# EAGLE design zxclone (EAGLE 6.4)
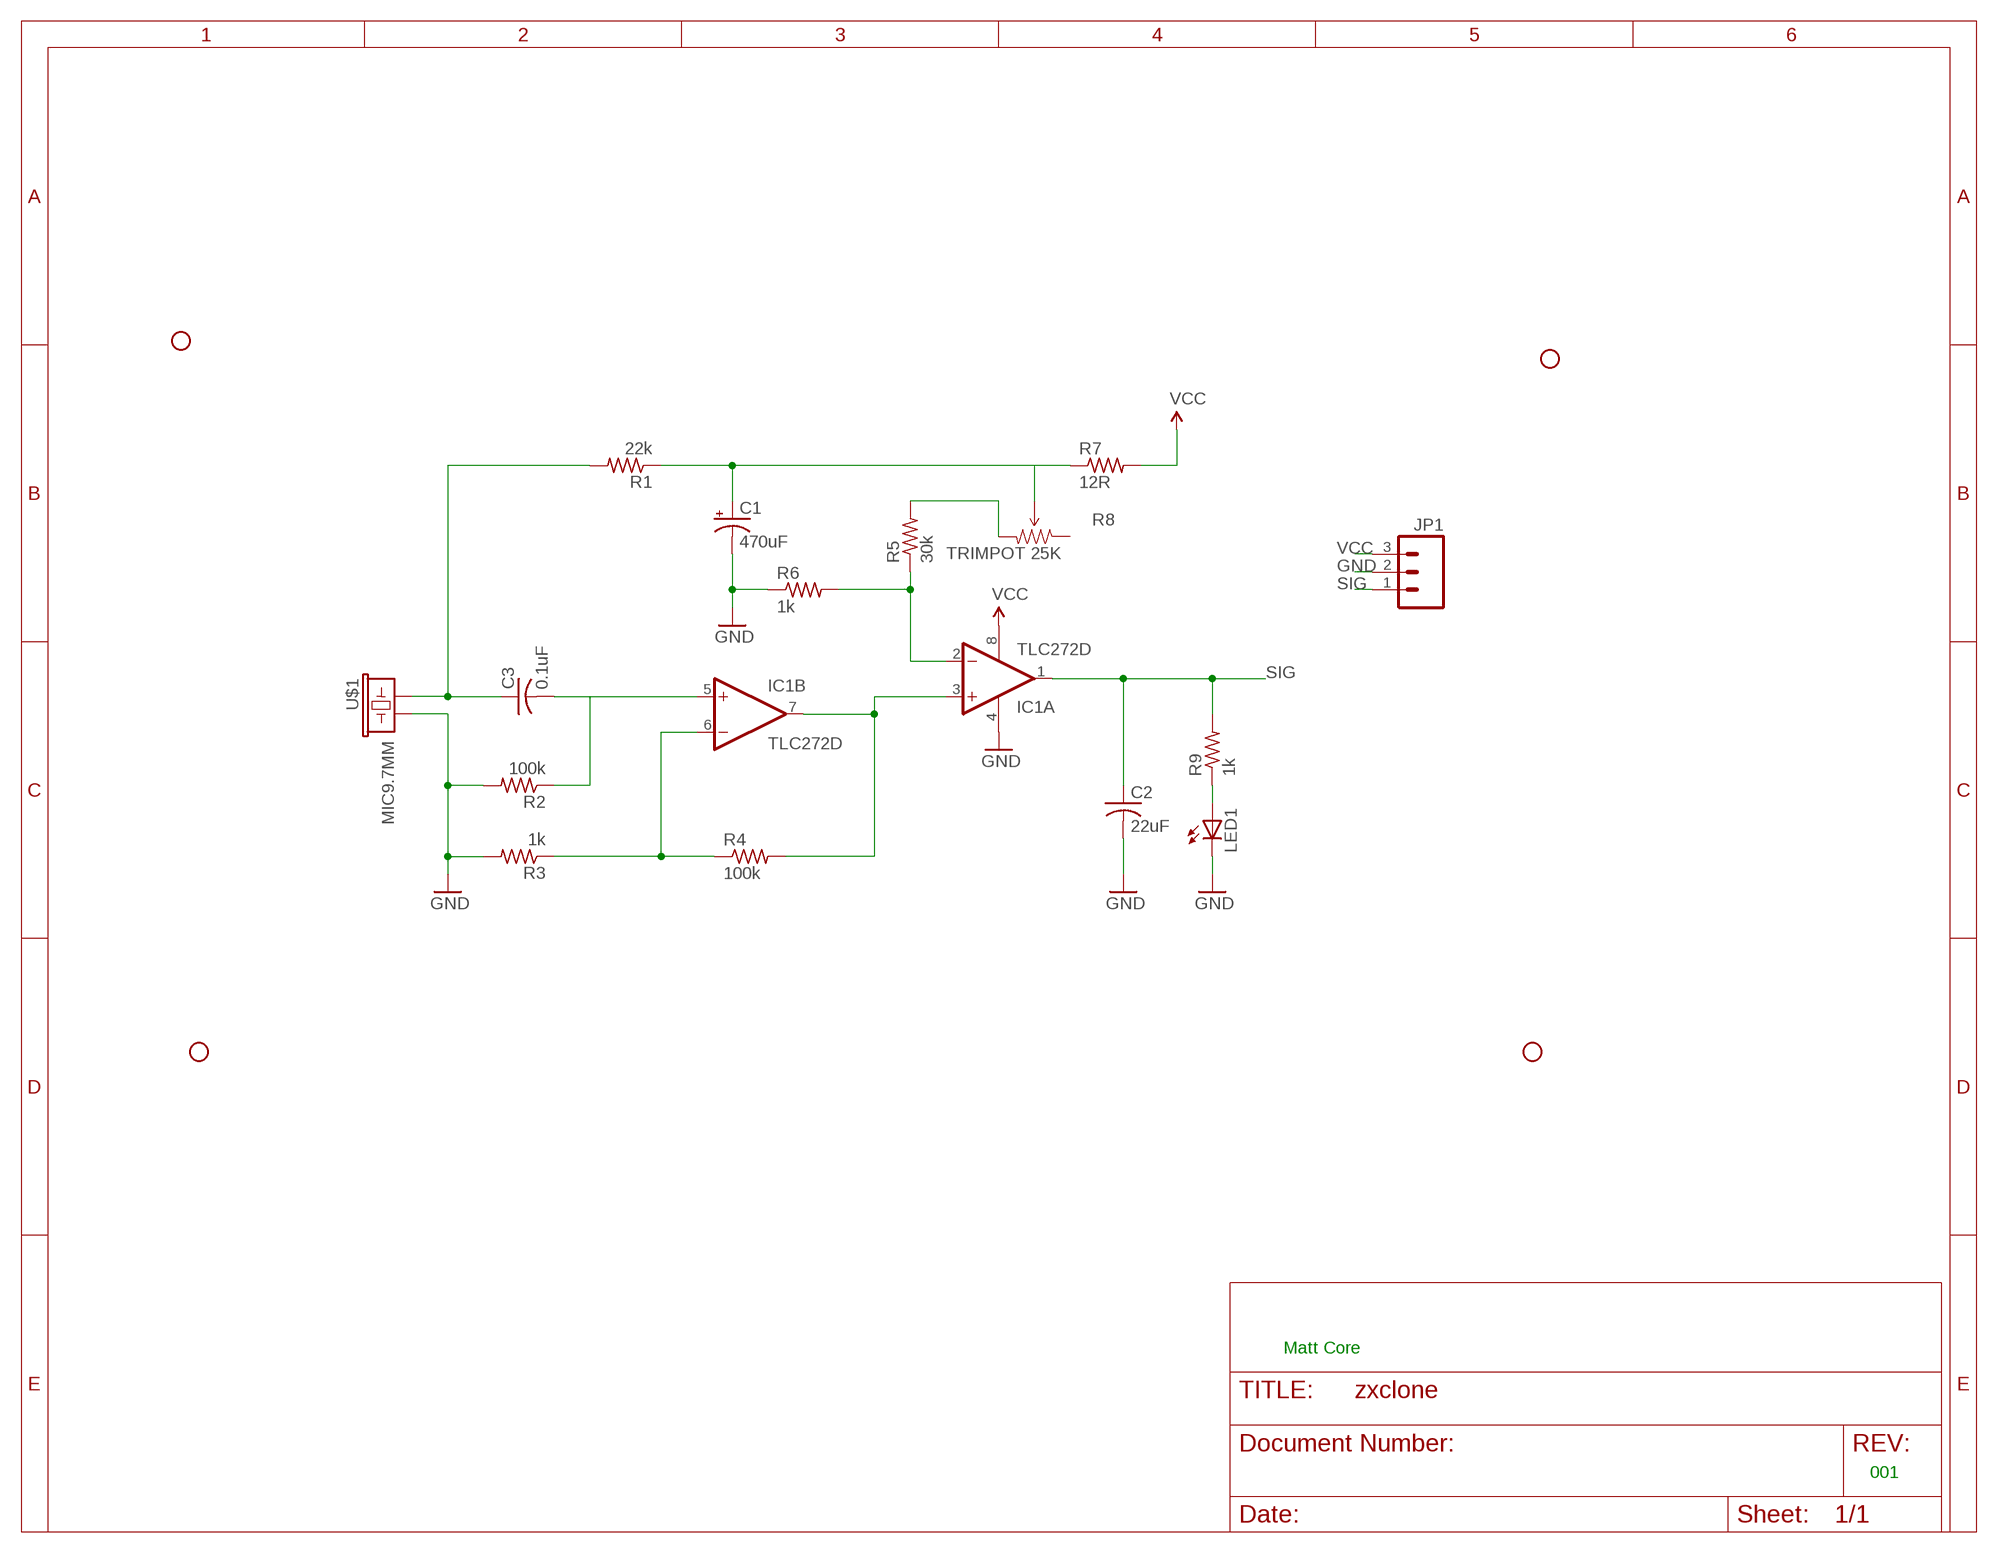
[diagram p0: schematic, sheet 1]

## Parts
C1  470uF  CPOL-USE2.5-7  [E2,5-7]
C2  22uF  C-USC1206  [C1206]
C3  0.1uF  C-USC1005  [C1005]
IC1  TLC272D  [SO08]
JP1  M03PTH  [1X03]
LED1  LEDSML0603  [SML0603]
R1  22k  R-US_R0402  [R0402]
R2  100k  R-US_R0402  [R0402]
R3  1k  R-US_R0402  [R0402]
R4  100k  R-US_R0402  [R0402]
R5  30k  R-US_R0402  [R0402]
R6  1k  R-US_R0402  [R0402]
R7  12R  R-US_R0805  [R0805]
R8  TRIMPOT 25K  TRIMPOT-2  [TRIMPOT_TC33]
R9  1k  R-US_R0402  [R0402]
STANDOFF1  STAND-OFF  [STAND-OFF]
STANDOFF2  STAND-OFF  [STAND-OFF]
STANDOFF3  STAND-OFF  [STAND-OFF]
STANDOFF4  STAND-OFF  [STAND-OFF]
U$1  MIC9.7MM  [MIC-9.7MM]

## Nets
GND [ground]: C1.- C2.2 IC1.4(P:V-) JP1.2 LED1.C R2.2 R3.2 R6.1 U$1.2
N$1 [vcc]: C1.+ R1.1 R7.1 R8.2(WIPER)
N$2: IC1.2(A:-IN) R5.1 R6.2
N$3: IC1.3(A:+IN) IC1.7(B:OUT) R4.2
N$4: IC1.6(B:-IN) R3.1 R4.1
N$5: C3.2 IC1.5(B:+IN) R2.1
N$6: R5.2 R8.3(CW)
N$7 [vcc]: C3.1 R1.2 U$1.1
N$8: LED1.A R9.1
SIG: C2.1 IC1.1(A:OUT) JP1.1 R9.2
VCC [vcc]: IC1.8(P:V+) JP1.3 R7.2
Unconnected: R8.1(CCW)

## Notes on the sheet
- Matt Core
- 001

## Library data of the parts
C1 = resistor:CPOL-US: POLARIZED CAPACITOR, American symbol
C2 C3 = resistor:C-US: CAPACITOR, American symbol
IC1 = linear:TLC272: OP AMP
JP1 = SparkFun-Connectors:M03: Header 3 Standard 3-pin 0.1" header. Use with straight break away headers (SKU : PRT-00116), right angle break away headers (PRT-00553), swiss pins (PRT-00743), machine pins (PRT-00117), and female headers (PRT-00115). Molex polarized connector foot print use with SKU : PRT-08232 with associated crimp pins and housings.
LED1 = led:LED: LED OSRAM: - CHIPLED LG R971, LG N971, LY N971, LG Q971, LY Q971, LO R971, LY R971 LH N974, LH R974 LS Q976, LO Q976, LY Q976 LO Q996 - Hyper CHIPLED LW Q18S LB Q993, LB Q99A, LB R99A - SideLED LS A670, LO A670, LY A670, LG A670, LP A670 LB A673, LV A673, LT A673, LW A673 LH A674 LY A675 LS A676, LA A676, LO A676, LY A676, LW A676 LS A679, LY A679, LG A679 - Hyper Micro SIDELED® LS Y876, LA Y876, LO Y876, LY Y876 LT Y87S - SmartLED LW L88C, LW L88S LB L89C, LB L89S, LG L890 LS L89K, LO L89K, LY L89K LS L896, LA L896, LO L896, LY L896 - TOPLED LS T670, LO T670, LY T670, LG T670, LP T670 LSG T670, LSP T670, LSY T670, LOP T670, LYG T670 LG T671, LOG T671, LSG T671 LB T673, LV T673, LT T673, LW T673 LH T674 LS T676, LA T676, LO T676, LY T676, LB T676, LH T676, LSB T676, LW T676 LB T67C, LV T67C, LT T67C, LS T67K, LO T67K, LY T67K, LW E67C LS E67B, LA E67B, LO E67B, LY E67B, LB E67C, LV E67C, LT E67C LW T67C LS T679, LY T679, LG T679 LS T770, LO T770, LY T770, LG T770, LP T770 LB T773, LV T773, LT T773, LW T773 LH T774 LS E675, LA E675, LY E675, LS T675 LS T776, LA T776, LO T776, LY T776, LB T776 LHGB T686 LT T68C, LB T68C - Hyper Mini TOPLED® LB M676 - Mini TOPLED Santana® LG M470 LS M47K, LO M47K, LY M47K Source: http://www.osram.convergy.de LUXEON: - LUMILED® LXK2-PW12-R00, LXK2-PW12-S00, LXK2-PW14-U00, LXK2-PW14-V00 LXK2-PM12-R00, LXK2-PM12-S00, LXK2-PM14-U00 LXK2-PE12-Q00, LXK2-PE12-R00, LXK2-PE12-S00, LXK2-PE14-T00, LXK2-PE14-U00 LXK2-PB12-K00, LXK2-PB12-L00, LXK2-PB12-M00, LXK2-PB14-N00, LXK2-PB14-P00, LXK2-PB14-Q00 LXK2-PR12-L00, LXK2-PR12-M00, LXK2-PR14-Q00, LXK2-PR14-R00 LXK2-PD12-Q00, LXK2-PD12-R00, LXK2-PD12-S00 LXK2-PH12-R00, LXK2-PH12-S00 LXK2-PL12-P00, LXK2-PL12-Q00, LXK2-PL12-R00 Source: www.luxeon.com KINGBRIGHT: KA-3528ASYC Source: www.kingbright.com
R1-R7 R9 = resistor:R-US_: RESISTOR, American symbol
R8 = SparkFun-Electromechanical:TRIMPOT: Various small potentiometers for "set-and-forget" applications
STANDOFF1-STANDOFF4 = SparkFun-Electromechanical:STAND-OFF: #4 Stand Off This is the mechanical footprint for a #4 phillips button head screw. Use the keepout ring to avoid running the screw head into surrounding components. SKU : PRT-00447
U$1 = SparkFun-Sensors:MIC: Omni-directional electret microphone. 9.7mm standard diameter.

## Net classes
1 ground: width 0.406 mm
2 vcc: width 0.406 mm

## Board
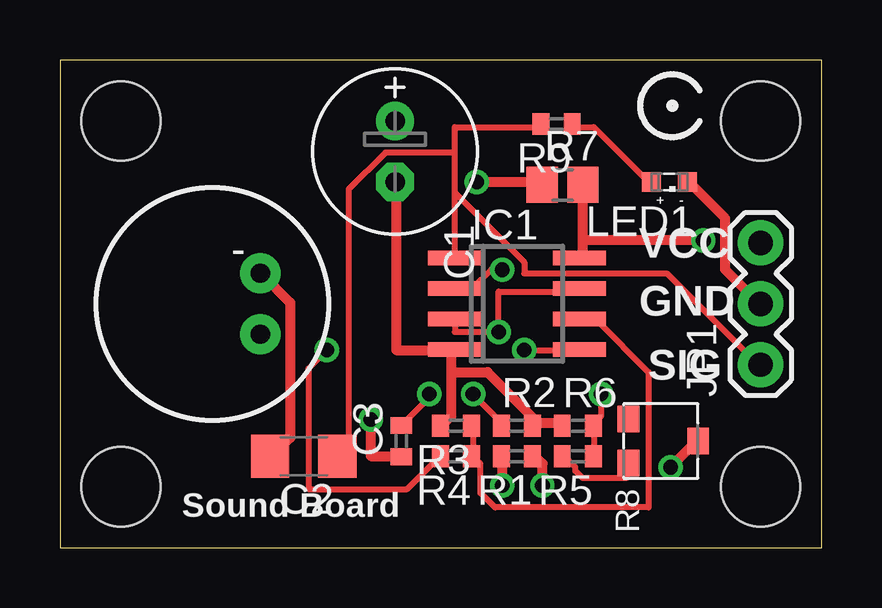
[diagram p1: board, top side]
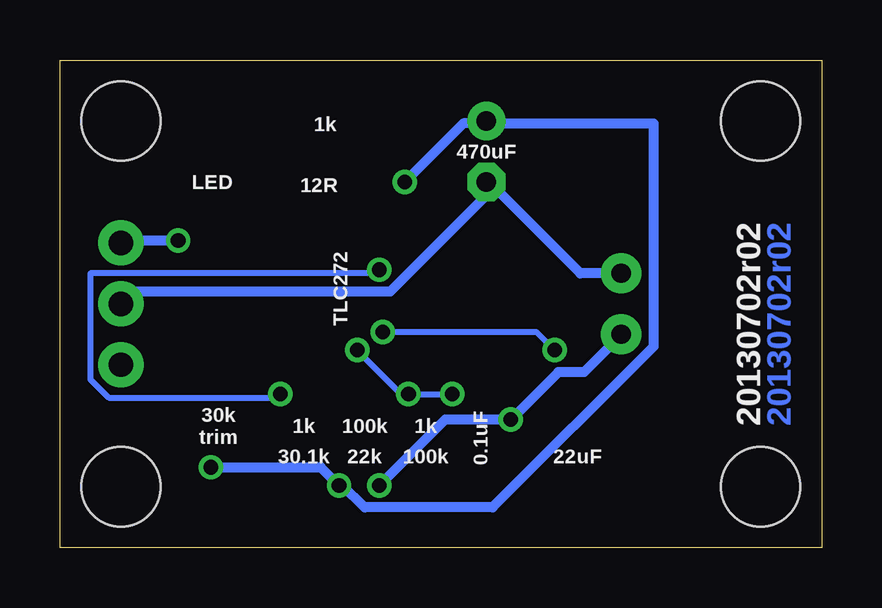
[diagram p2: board, bottom side, seen from below]

Size 31.75 x 20.32 mm. Coordinates in mm from the lower left corner, seen from the top.
Outline: 0,0 31.75,0 31.75,20.32 0,20.31 0,0
Copper layers (1*16): Top 0.035mm / dielectric 1.5mm / Bottom 0.035mm
Design rules "default *": minimum track width 10mil, minimum drill 24mil, track to track 8mil, track to pad 8mil, pad to pad 8mil, via to via 8mil, smd to smd 8mil, copper to edge 40mil, drill to drill 8mil, minimum pad ring 10mil, minimum via ring 8mil, stop-mask expansion 4mil, vias tented up to drill 25mil, thermal gap 10mil

### Footprints (pad centres in the part's own frame; a part is rotated, then mirrored left to right if it is on the bottom)
E2,5-7 = drill 0.813 pad 1.6: + -1.27,0 | drill 0.813 pad 1.6 octagon: - 1.27,0
C1206 = smd 1.6 x 1.8: 1 -1.4,0; 2 1.4,0
C1005 = smd 0.7 x 0.9: 1 -0.65,0; 2 0.65,0
SO08 = smd 0.6 x 2.2: 1 -1.905,-2.6; 2 -0.635,-2.6; 3 0.635,-2.6; 4 1.905,-2.6; 5 1.905,2.6; 6 0.635,2.6; 7 -0.635,2.6; 8 -1.905,2.6
1X03 = drill 1.016 pad 1.88: 1 0,0; 2 2.54,0; 3 5.08,0
SML0603 = smd 0.8 x 0.8: A 0.75,0; C -0.75,0
R0402 = smd 0.7 x 0.9: 1 -0.65,0; 2 0.65,0
R0805 = smd 1.3 x 1.5: 1 -0.85,0; 2 0.85,0
TRIMPOT_TC33 = smd 1.1 x 0.9: 1 -0.91,-1.45; 2 0,1.45; 3 0.91,-1.45
STAND-OFF = hole 3.302: 0,0
MIC-9.7MM = drill 0.8 pad 1.676: 1 -2,1.27; 2 -2,-1.27

### Placement (x,y rotation side)
C1  13.97,16.51 270 top
C2  10.16,3.81 180 top
C3  14.22,4.45 90 top
FRAME1  FRAME-LETTER  [CREATIVE_COMMONS]  5.08,22.86 0 top
IC1  19.05,10.16 270 top
JP1  29.21,7.62 90 top
LED1  25.4,15.24 180 top
R1  19.05,3.81 180 top
R2  19.05,5.08 0 top
R3  16.51,5.08 180 top
R4  16.51,3.81 180 top
R5  21.59,3.81 180 top
R6  21.59,5.08 0 top
R7  20.95,15.11 0 top
R8  25.15,4.45 270 top
R9  20.7,17.65 180 top
STANDOFF1  2.54,17.78 0 top
STANDOFF2  29.21,17.78 0 top
STANDOFF3  2.54,2.54 0 top
STANDOFF4  29.21,2.54 0 top
U$1  6.35,10.16 180 top

### Tracks (layer width: path | path; a pad name or v marks a point on that pad's centre or on a via)
GND
  Top 0.406: LED1.C 26.21,15.24 27.74,13.72 27.74,11.58 29.11,10.21 JP1.2 | R6.1 20.88,5.18 19.81,5.18 R2.2 19.81,5.33 17.83,7.32 16.31,7.32 | 16.31,7.32 16.31,8.23 IC1.4 16.15,8.23 14.02,8.23 14.02,15.24 C1.- | 16.31,7.32 16.31,5.49 16,5.18 R3.2 | C2.2 8.84,3.81 9.6,4.57 9.6,10.21 8.38,11.43 U$1.2
  Bottom 0.406: U$1.2 10.06,11.43 13.87,15.24 C1.- 13.72,14.94 17.98,10.67 28.65,10.67 29.11,10.21 JP1.2
N$1  (via drill 0.61)
  Top 0.406: v20.12,2.59 20.12,3.5 19.81,3.81 R1.1 | v25.45,3.35 26.52,4.42 R8.2 | v17.37,15.24 19.96,15.24 R7.1
  Bottom 0.406: v25.45,3.35 20.88,3.35 v20.12,2.59 19.96,2.59 19.05,1.68 13.72,1.68 7.01,8.38 7.01,17.68 13.87,17.68 C1.+ 14.02,17.68 14.94,17.68 v17.37,15.24
N$2  (via drill 0.61)
  Top 0.254: R5.1 22.25,5.03 R6.2 22.25,5.18 22.55,5.49 v22.55,6.4 | v18.44,11.58 17.98,11.58 17.22,10.82 16.46,10.82 IC1.2
  Bottom 0.254: v22.55,6.4 22.71,6.25 29.72,6.25 30.48,7.01 30.48,11.43 18.59,11.43 v18.44,11.58
N$3  (via drill 0.61)
  Top 0.254: v11.12,8.23 10.36,7.47 10.36,2.44 14.48,2.44 R4.2 | IC1.3 16.46,9.45 16.46,8.99 v18.29,8.99 18.29,10.67 21.64,10.67 IC1.7
  Bottom 0.254: v11.12,8.23 11.89,8.99 v18.29,8.99
N$4
  Top 0.254: 17.22,3.81 17.22,5.03 R3.1 | 17.22,3.81 17.53,3.5 17.53,2.29 18.14,1.68 24.54,1.68 24.54,7.32 22.4,9.45 21.79,9.45 IC1.6 | 17.22,3.81 R4.1
N$5  (via drill 0.61)
  Top 0.254: v15.39,6.4 15.39,6.25 14.33,5.18 C3.2 | v17.22,6.4 18.29,5.33 18.29,5.18 R2.1 | v19.36,8.23 21.64,8.23 IC1.5
  Bottom 0.254: v15.39,6.4 v17.22,6.4 17.53,6.4 v19.36,8.23
N$6
  Top 0.254: R5.2 21.03,3.81 21.49,3.35 21.49,3.2 21.79,2.9 23.62,2.9 23.62,3.5 R8.3
N$7  (via drill 0.61)
  Top 0.406: v12.95,5.33 12.95,3.81 14.17,3.81 C3.1 | v18.44,2.59 18.44,3.81 R1.2
  Bottom 0.406: U$1.1 8.38,8.84 9.91,7.32 10.97,7.32 v12.95,5.33 15.7,5.33 v18.44,2.59
N$8
  Top 0.254: LED1.A 24.54,15.24 22.25,17.53 21.49,17.53 R9.1
SIG
  Top 0.254: 16.46,14.78 16.46,12.19 IC1.1 | 16.46,14.78 16.46,16.46 | 16.46,16.46 16.46,17.53 19.96,17.53 R9.2 | 16.46,16.46 13.56,16.46 12.04,14.94 12.04,4.27 11.58,3.81 C2.1 | 16.46,14.78 19.36,11.89 19.36,11.43 25.3,11.43 29.11,7.62 JP1.1
VCC  (via drill 0.61)
  Top 0.406: 21.79,12.8 21.79,12.19 IC1.8 | 21.79,12.8 21.79,15.09 R7.2 | v26.82,12.8 21.79,12.8
  Bottom 0.406: v26.82,12.8 29.11,12.8 JP1.3

### Text on the board
Bottom: 20130702r02
tPlace: + | - | VCC | GND | SIG | Sound Board
bPlace: 1k | 470uF | 12R | LED | TLC272 | 20130702r02 | 0.1uF | 1k | 100k | 1k | 30k / trim | 22uF | 100k | 22k | 30.1k